# EAGLE schematic MKRZero_SensorPCB_v44 (EAGLE 9.7.0)
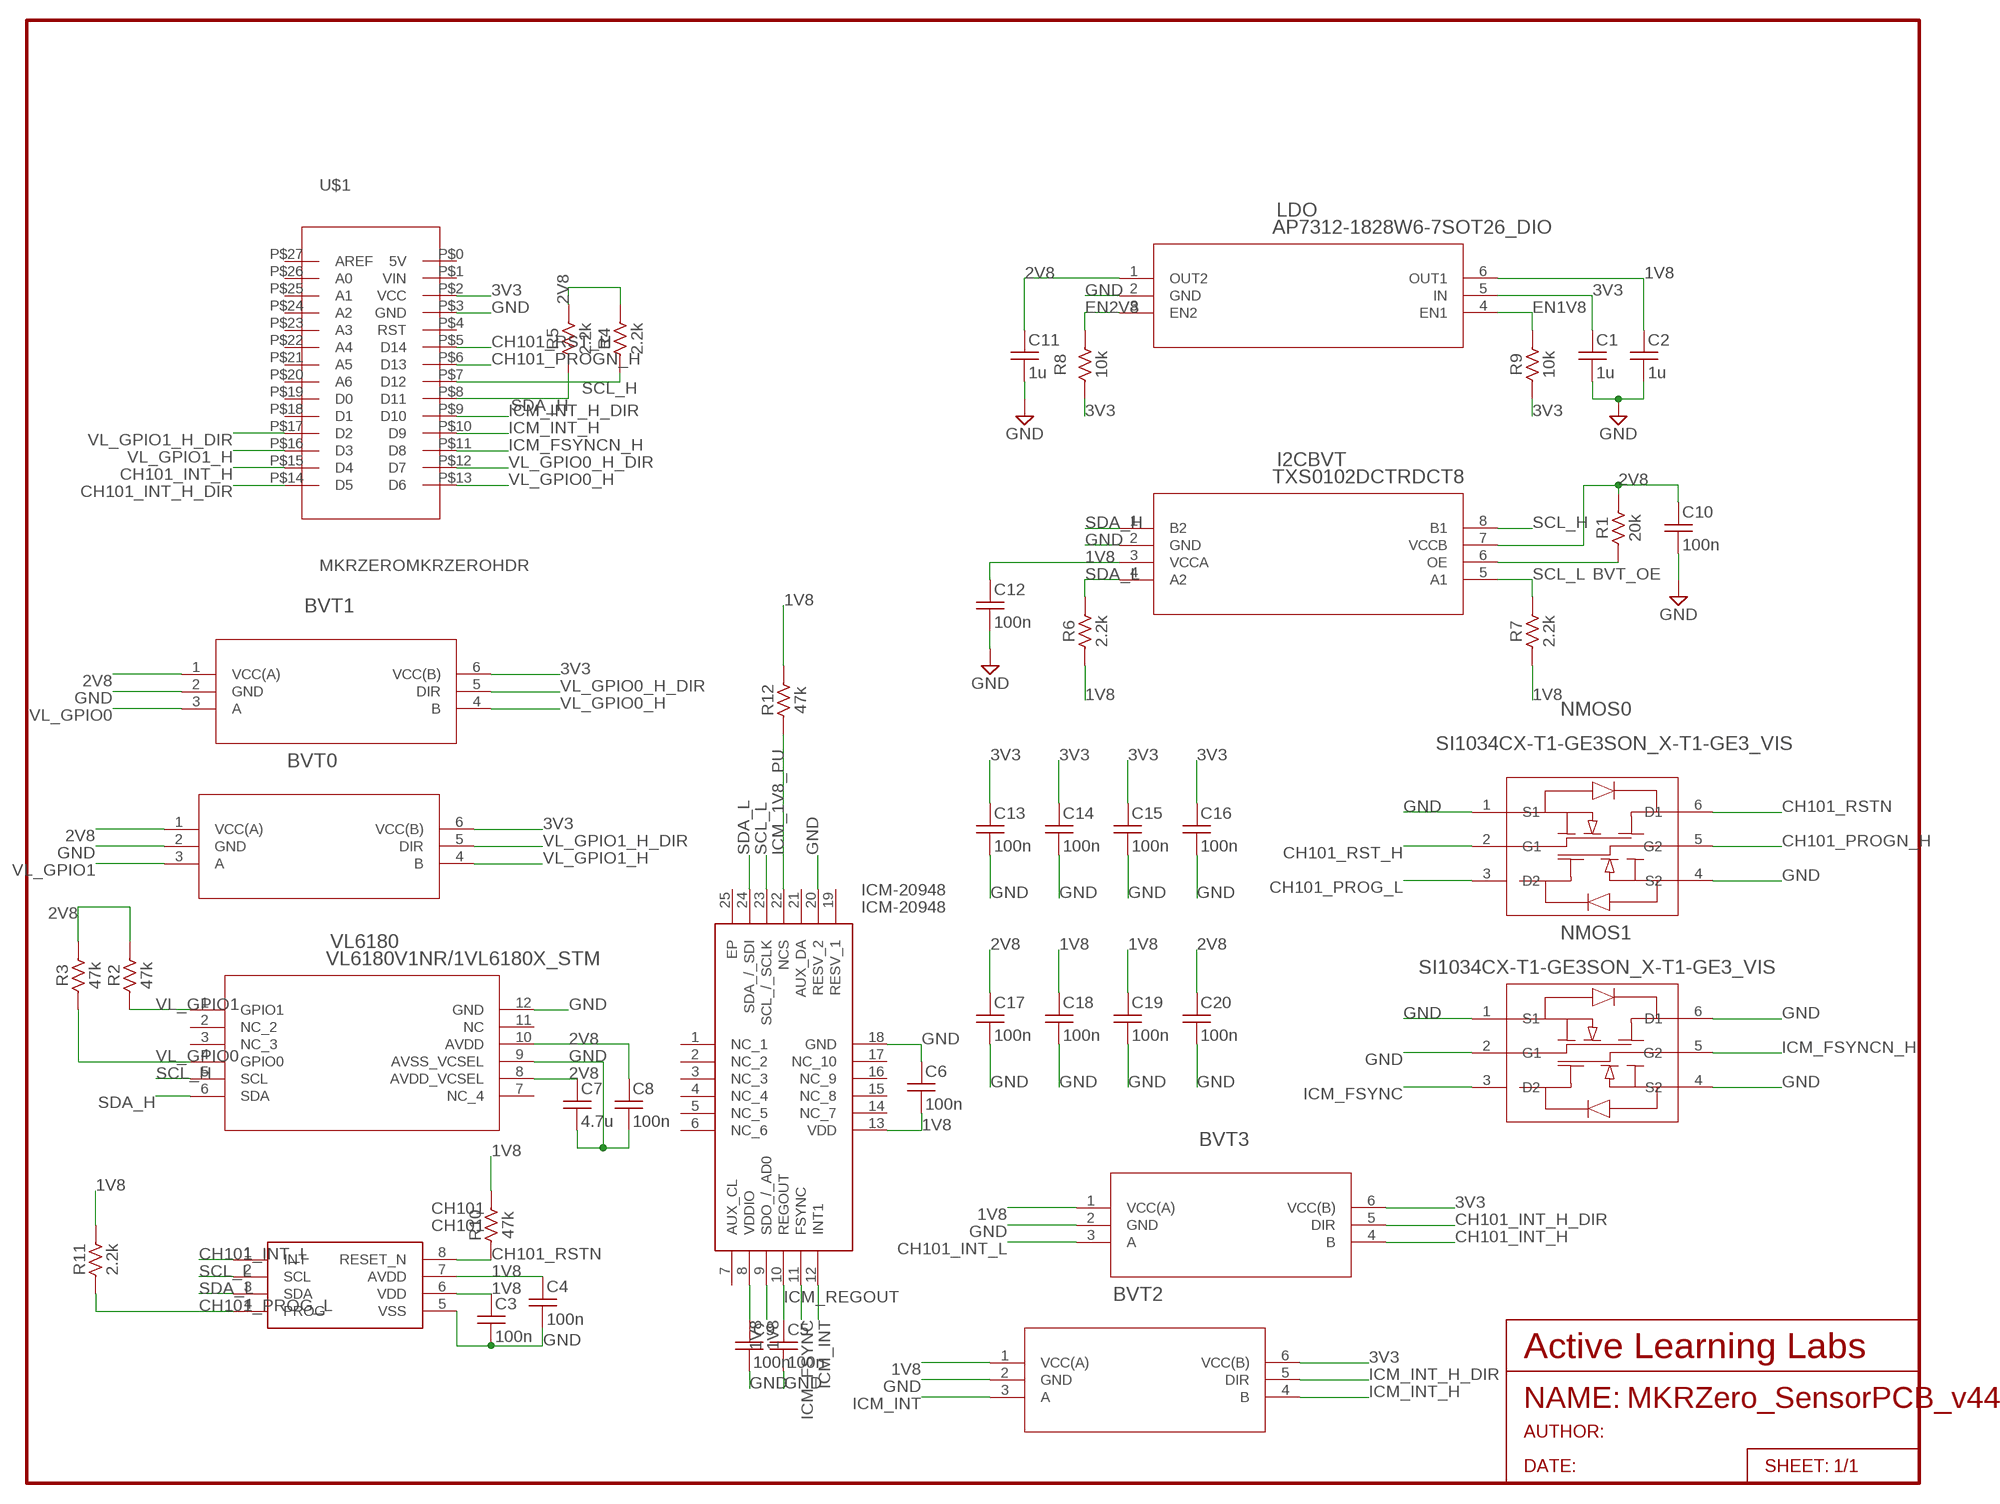
[diagram p0: schematic, sheet 1]

## Parts
BVT0  74LVC1T45GW,125TSSOP6_SOT363-2_NEX  [TSSOP6_SOT363-2_NEX]
BVT1  74LVC1T45GW,125TSSOP6_SOT363-2_NEX  [TSSOP6_SOT363-2_NEX]
BVT2  74LVC1T45GW,125TSSOP6_SOT363-2_NEX  [TSSOP6_SOT363-2_NEX]
BVT3  74LVC1T45GW,125TSSOP6_SOT363-2_NEX  [TSSOP6_SOT363-2_NEX]
C1  1u  C-US0603  [0603]
C2  1u  C-US0603  [0603]
C3  100n  C-US0603  [0603]
C4  100n  C-US0603  [0603]
C5  100n  C-US0603  [0603]
C6  100n  C-US0603  [0603]
C7  4.7u  C-US0603  [0603]
C8  100n  C-US0603  [0603]
C9  100n  C-US0603  [0603]
C10  100n  C-US0603  [0603]
C11  1u  C-US0603  [0603]
C12  100n  C-US0603  [0603]
C13  100n  C-US0603  [0603]
C14  100n  C-US0603  [0603]
C15  100n  C-US0603  [0603]
C16  100n  C-US0603  [0603]
C17  100n  C-US0603  [0603]
C18  100n  C-US0603  [0603]
C19  100n  C-US0603  [0603]
C20  100n  C-US0603  [0603]
CH101  CH101  [CH101]
I2CBVT  TXS0102DCTRDCT8  [DCT8]
ICM-20948  ICM-20948  [QFN40P300X300X105-25N]
LDO  AP7312-1828W6-7SOT26_DIO  [SOT26_DIO]
NMOS0  SI1034CX-T1-GE3SON_X-T1-GE3_VIS  [SON_X-T1-GE3_VIS]
NMOS1  SI1034CX-T1-GE3SON_X-T1-GE3_VIS  [SON_X-T1-GE3_VIS]
R1  20k  R-US0603  [0603]
R2  47k  R-US0603  [0603]
R3  47k  R-US0603  [0603]
R4  2.2k  R-US0603  [0603]
R5  2.2k  R-US0603  [0603]
R6  2.2k  R-US0603  [0603]
R7  2.2k  R-US0603  [0603]
R8  10k  R-US0603  [0603]
R9  10k  R-US0603  [0603]
R10  47k  R-US0603  [0603]
R11  2.2k  R-US0603  [0603]
R12  47k  R-US0603  [0603]
U$1  MKRZEROMKRZEROHDR  [MKRZEROHDR]
VL6180  VL6180V1NR/1VL6180X_STM  [VL6180X_STM]

## Nets
1V8: BVT2.1(VCC(A)) BVT3.1(VCC(A)) C2.1 C3.1 C4.1 C6.2 C9.1 C12.1 C18.1 C19.1 CH101.6(VDD) CH101.7(AVDD) I2CBVT.3(VCCA) ICM-20948.8(VDDIO) ICM-20948.9(SDO_/_AD0) ICM-20948.13(VDD) LDO.6(OUT1) R6.1 R7.1 R10.2 R11.2 R12.2
2V8: BVT0.1(VCC(A)) BVT1.1(VCC(A)) C7.1 C8.1 C10.1 C11.1 C17.1 C20.1 I2CBVT.7(VCCB) LDO.1(OUT2) R1.2 R2.2 R3.2 R4.2 R5.2 VL6180.8(AVDD_VCSEL) VL6180.10(AVDD)
3V3: BVT0.6(VCC(B)) BVT1.6(VCC(B)) BVT2.6(VCC(B)) BVT3.6(VCC(B)) C1.1 C13.1 C14.1 C15.1 C16.1 LDO.5(IN) R8.1 R9.1 U$1.P$2(VCC)
BVT_OE: I2CBVT.6(OE) R1.1
CH101_INT_H: BVT3.4(B) U$1.P$15(D4)
CH101_INT_H_DIR: BVT3.5(DIR) U$1.P$14(D5)
CH101_INT_L: BVT3.3(A) CH101.1(INT)
CH101_PROG_L: CH101.4(PROG) NMOS0.3(D2) R11.1
CH101_PROGN_H: NMOS0.5(G2) U$1.P$6(D13)
CH101_RST_H: NMOS0.2(G1) U$1.P$5(D14)
CH101_RSTN: CH101.8(RESET_N) NMOS0.6(D1) R10.1
EN1V8: LDO.4(EN1) R9.2
EN2V8: LDO.3(EN2) R8.2
GND [ground]: BVT0.2(GND) BVT1.2(GND) BVT2.2(GND) BVT3.2(GND) C1.2 C2.2 C3.2 C4.2 C5.2 C6.1 C7.2 C8.2 C9.2 C10.2 C11.2 C12.2 C13.2 C14.2 C15.2 C16.2 C17.2 C18.2 C19.2 C20.2 CH101.5(VSS) I2CBVT.2(GND) ICM-20948.18(GND) ICM-20948.20(RESV_2) LDO.2(GND) NMOS0.1(S1) NMOS0.4(S2) NMOS1.1(S1) NMOS1.2(G1) NMOS1.4(S2) NMOS1.6(D1) U$1.P$3(GND) VL6180.9(AVSS_VCSEL) VL6180.12(GND)
ICM_1V8_PU: ICM-20948.22(NCS) R12.1
ICM_FSYNC: ICM-20948.11(FSYNC) NMOS1.3(D2)
ICM_FSYNCN_H: NMOS1.5(G2) U$1.P$11(D8)
ICM_INT: BVT2.3(A) ICM-20948.12(INT1)
ICM_INT_H: BVT2.4(B) U$1.P$10(D9)
ICM_INT_H_DIR: BVT2.5(DIR) U$1.P$9(D10)
ICM_REGOUT: C5.1 ICM-20948.10(REGOUT)
SCL_H: I2CBVT.8(B1) R4.1 U$1.P$7(D12) VL6180.5(SCL)
SCL_L: CH101.2(SCL) I2CBVT.5(A1) ICM-20948.23(SCL_/_SCLK) R7.2
SDA_H: I2CBVT.1(B2) R5.1 U$1.P$8(D11) VL6180.6(SDA)
SDA_L: CH101.3(SDA) I2CBVT.4(A2) ICM-20948.24(SDA_/_SDI) R6.2
VL_GPIO0: BVT1.3(A) R3.1 VL6180.4(GPIO0)
VL_GPIO0_H: BVT1.4(B) U$1.P$13(D6)
VL_GPIO0_H_DIR: BVT1.5(DIR) U$1.P$12(D7)
VL_GPIO1: BVT0.3(A) R2.1 VL6180.1(GPIO1)
VL_GPIO1_H: BVT0.4(B) U$1.P$16(D3)
VL_GPIO1_H_DIR: BVT0.5(DIR) U$1.P$17(D2)
Unconnected: ICM-20948.1(NC_1) ICM-20948.2(NC_2) ICM-20948.3(NC_3) ICM-20948.4(NC_4) ICM-20948.5(NC_5) ICM-20948.6(NC_6) ICM-20948.7(AUX_CL) ICM-20948.14(NC_7) ICM-20948.15(NC_8) ICM-20948.16(NC_9) ICM-20948.17(NC_10) ICM-20948.19(RESV_1) ICM-20948.21(AUX_DA) ICM-20948.25(EP) U$1.P$4(RST) U$1.P$18(D1) U$1.P$19(D0) U$1.P$20(A6) U$1.P$21(A5) U$1.P$22(A4) U$1.P$23(A3) U$1.P$24(A2) U$1.P$25(A1) U$1.P$26(A0) VL6180.2(NC_2) VL6180.3(NC_3) VL6180.7(NC_4) VL6180.11(NC)

## Power pins joined to a net without a drawn wire
5V: U$1.P$0(5V)
AREF: U$1.P$27(AREF)
VIN: U$1.P$1(VIN)

## Library data of the parts
BVT0 BVT1-BVT3 = DIRVtrans:74LVC1T45GW,125; COPYRIGHT: Copyright (C) 2024 Ultra Librarian. All rights reserved.; MANUFACTURER_PART_NUMBER: 74LVC1T45GW,125; MFR_NAME: Nexperia
C1-C20 = esbd-passives:C-US: CAPACITOR US symbol
CH101 = CH101:CH101: Ultrasonic ToF (Time-of-Flight) Sensors, Operating Range=4cm to 1.2m, Current Consumption=13?A (1 sample/sec:10cm max range) Source: Datasheet <https://3cfeqx1hf82y3xcoull08ihx-wpengine.netdna-ssl.com/wp-content/uploads/2021/01/DS-000331-CH101-v1.4.pdf>; DESCRIPTION: Ultrasonic ToF (Time-of-Flight) Sensors, Operating Range=4cm to 1.2m, Current Consumption=13?A (1 sample/sec:10cm max range); HEIGHT: 1.36mm; MANUFACTURER_NAME: TDK; MANUFACTURER_PART_NUMBER: CH101
I2CBVT = VTransSM8:TXS0102DCTR; COPYRIGHT: Copyright (C) 2024 Ultra Librarian. All rights reserved.; MANUFACTURER_PART_NUMBER: TXS0102DCTR; MFR_NAME: Texas Instruments
ICM-20948 = ICM-20948:ICM-20948: IMUs - Inertial Measurement Units World's Lowest Power 9-Axis MEMS MotionTracking Device Source: Datasheet <https://product.tdk.com/system/files/dam/doc/product/sensor/mortion-inertial/imu/data_sheet/ds-000189-icm-20948-v1.3.pdf>; ARROW_PART_NUMBER: ICM-20948; ARROW_PRICE-STOCK: https://www.arrow.com/en/products/icm-20948/invensense?region=nac; DESCRIPTION: IMUs - Inertial Measurement Units World's Lowest Power 9-Axis MEMS MotionTracking Device; HEIGHT: 1.05mm; MANUFACTURER_NAME: TDK; MANUFACTURER_PART_NUMBER: ICM-20948; MOUSER_PART_NUMBER: 410-ICM-20948; MOUSER_PRICE-STOCK: https://www.mouser.co.uk/ProductDetail/TDK-InvenSense/ICM-20948?qs=u4fy%2FsgLU9OtGc31yF%2Friw%3D%3D
LDO = 2024-03-10_16-29-08_Library:AP7312-1828W6-7; COPYRIGHT: Copyright (C) 2024 Ultra Librarian. All rights reserved.; MANUFACTURER_PART_NUMBER: AP7312-1828W6-7; MFR_NAME: Diodes Inc
NMOS0 NMOS1 = NMOS:SI1034CX-T1-GE3; COPYRIGHT: Copyright (C) 2024 Ultra Librarian. All rights reserved.; MANUFACTURER_PART_NUMBER: SI1034CX-T1-GE3; MFR_NAME: Vishay
R1-R12 = esbd-passives:R-US: RESISTOR US symbol
U$1 = Conn:MKRZERO
VL6180 = 2024-03-09_22-22-41_Library:VL6180V1NR/1; COPYRIGHT: Copyright (C) 2024 Ultra Librarian. All rights reserved.; MANUFACTURER_PART_NUMBER: VL6180V1NR/1; MFR_NAME: STMicroelectronics

## Net classes
1 ground: width 0.254 mm